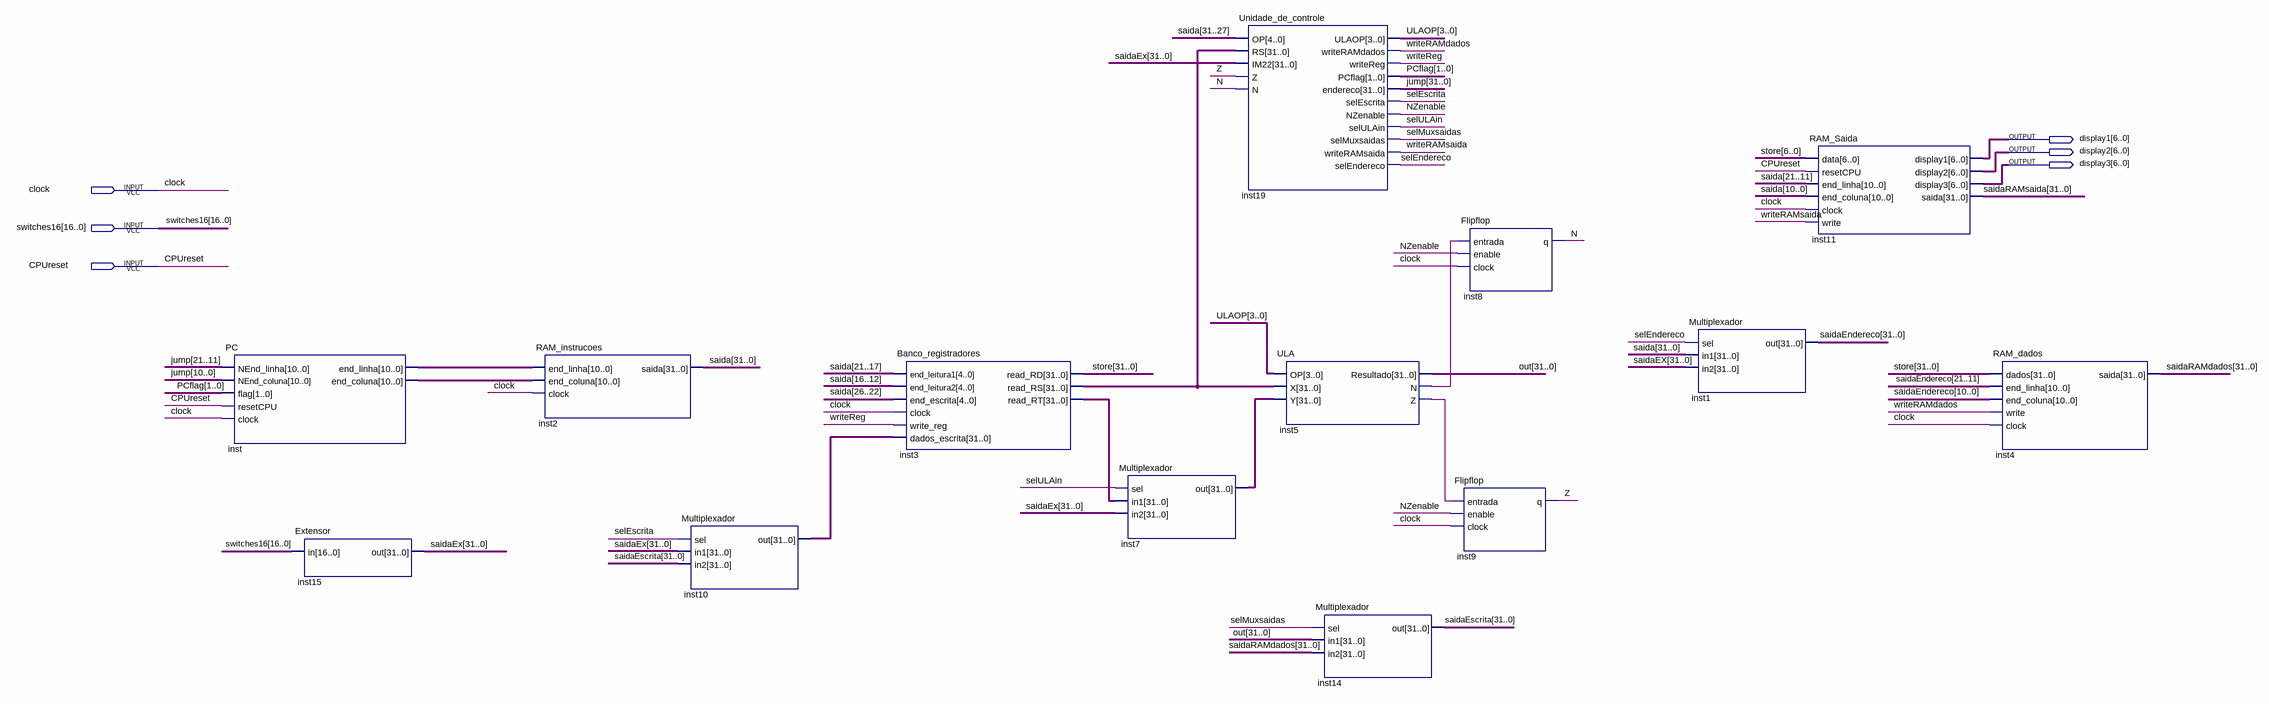
[diagram p0: schematic sheet]
// Quartus schematic CPU.bdf as structural Verilog: 14 symbols, 6 pins
module CPU (
  input  clock,
  input  [16:0] switches16,
  input  CPUreset,
  output [6:0] display1,
  output [6:0] display2,
  output [6:0] display3
);

  wire inst5_n, inst5_z, N, NZenable, selEndereco, selEscrita, selMuxsaidas, selULAin, writeRAMdados,
       writeRAMsaida, writeReg, Z;
  wire [1:0] PCflag;
  wire [3:0] ULAOP;
  wire [10:0] inst_end_coluna, inst_end_linha;
  wire [31:0] inst3_read_rs, inst3_read_rt, inst7_out, inst10_out, jump, out, saida, saidaEndereco,
       saidaEscrita, saidaEx, saidaRAMdados, saidaRAMsaida, store;

  PC inst (
    .NEnd_linha(jump[21:11]), .NEnd_coluna(jump[10:0]), .flag(PCflag), .resetCPU(CPUreset), .clock(clock),
    .end_linha(inst_end_linha), .end_coluna(inst_end_coluna));
  Extensor inst15 (.in(switches16), .out(saidaEx));
  RAM_instrucoes inst2 (.end_linha(inst_end_linha), .end_coluna(inst_end_coluna), .clock(clock), .saida(saida));
  Multiplexador inst10 (.sel(selEscrita), .in1(saidaEx), .in2(saidaEscrita), .out(inst10_out));
  Banco_registradores inst3 (
    .end_leitura1(saida[21:17]), .end_leitura2(saida[16:12]), .end_escrita(saida[26:22]), .clock(clock),
    .write_reg(writeReg), .dados_escrita(inst10_out), .read_RD(store), .read_RS(inst3_read_rs),
    .read_RT(inst3_read_rt));
  Multiplexador inst7 (.sel(selULAin), .in1(inst3_read_rt), .in2(saidaEx), .out(inst7_out));
  Unidade_de_controle inst19 (
    .OP(saida[31:27]), .RS(inst3_read_rs), .IM22(saidaEx), .Z(Z), .N(N), .ULAOP(ULAOP),
    .writeRAMdados(writeRAMdados), .writeReg(writeReg), .PCflag(PCflag), .endereco(jump),
    .selEscrita(selEscrita), .NZenable(NZenable), .selULAin(selULAin), .selMuxsaidas(selMuxsaidas),
    .writeRAMsaida(writeRAMsaida), .selEndereco(selEndereco));
  ULA inst5 (.OP(ULAOP), .X(inst3_read_rs), .Y(inst7_out), .Resultado(out), .N(inst5_n), .Z(inst5_z));
  Multiplexador inst14 (.sel(selMuxsaidas), .in1(out), .in2(saidaRAMdados), .out(saidaEscrita));
  Flipflop inst8 (.entrada(inst5_n), .enable(NZenable), .clock(clock), .q(N));
  Flipflop inst9 (.entrada(inst5_z), .enable(NZenable), .clock(clock), .q(Z));
  Multiplexador inst1 (.sel(selEndereco), .in1(saida), .in2(saidaEx), .out(saidaEndereco));
  RAM_Saida inst11 (
    .data(store[6:0]), .resetCPU(CPUreset), .end_linha(saida[21:11]), .end_coluna(saida[10:0]),
    .clock(clock), .write(writeRAMsaida), .display1(display1), .display2(display2), .display3(display3),
    .saida(saidaRAMsaida));
  RAM_dados inst4 (
    .dados(store), .end_linha(saidaEndereco[21:11]), .end_coluna(saidaEndereco[10:0]), .write(writeRAMdados),
    .clock(clock), .saida(saidaRAMdados));
endmodule
